# Altium schematic sheet MCISO-S03-V00-CAN_MAIN.SchDoc
size A3; SheetNumber: 6; SheetTotal: 8
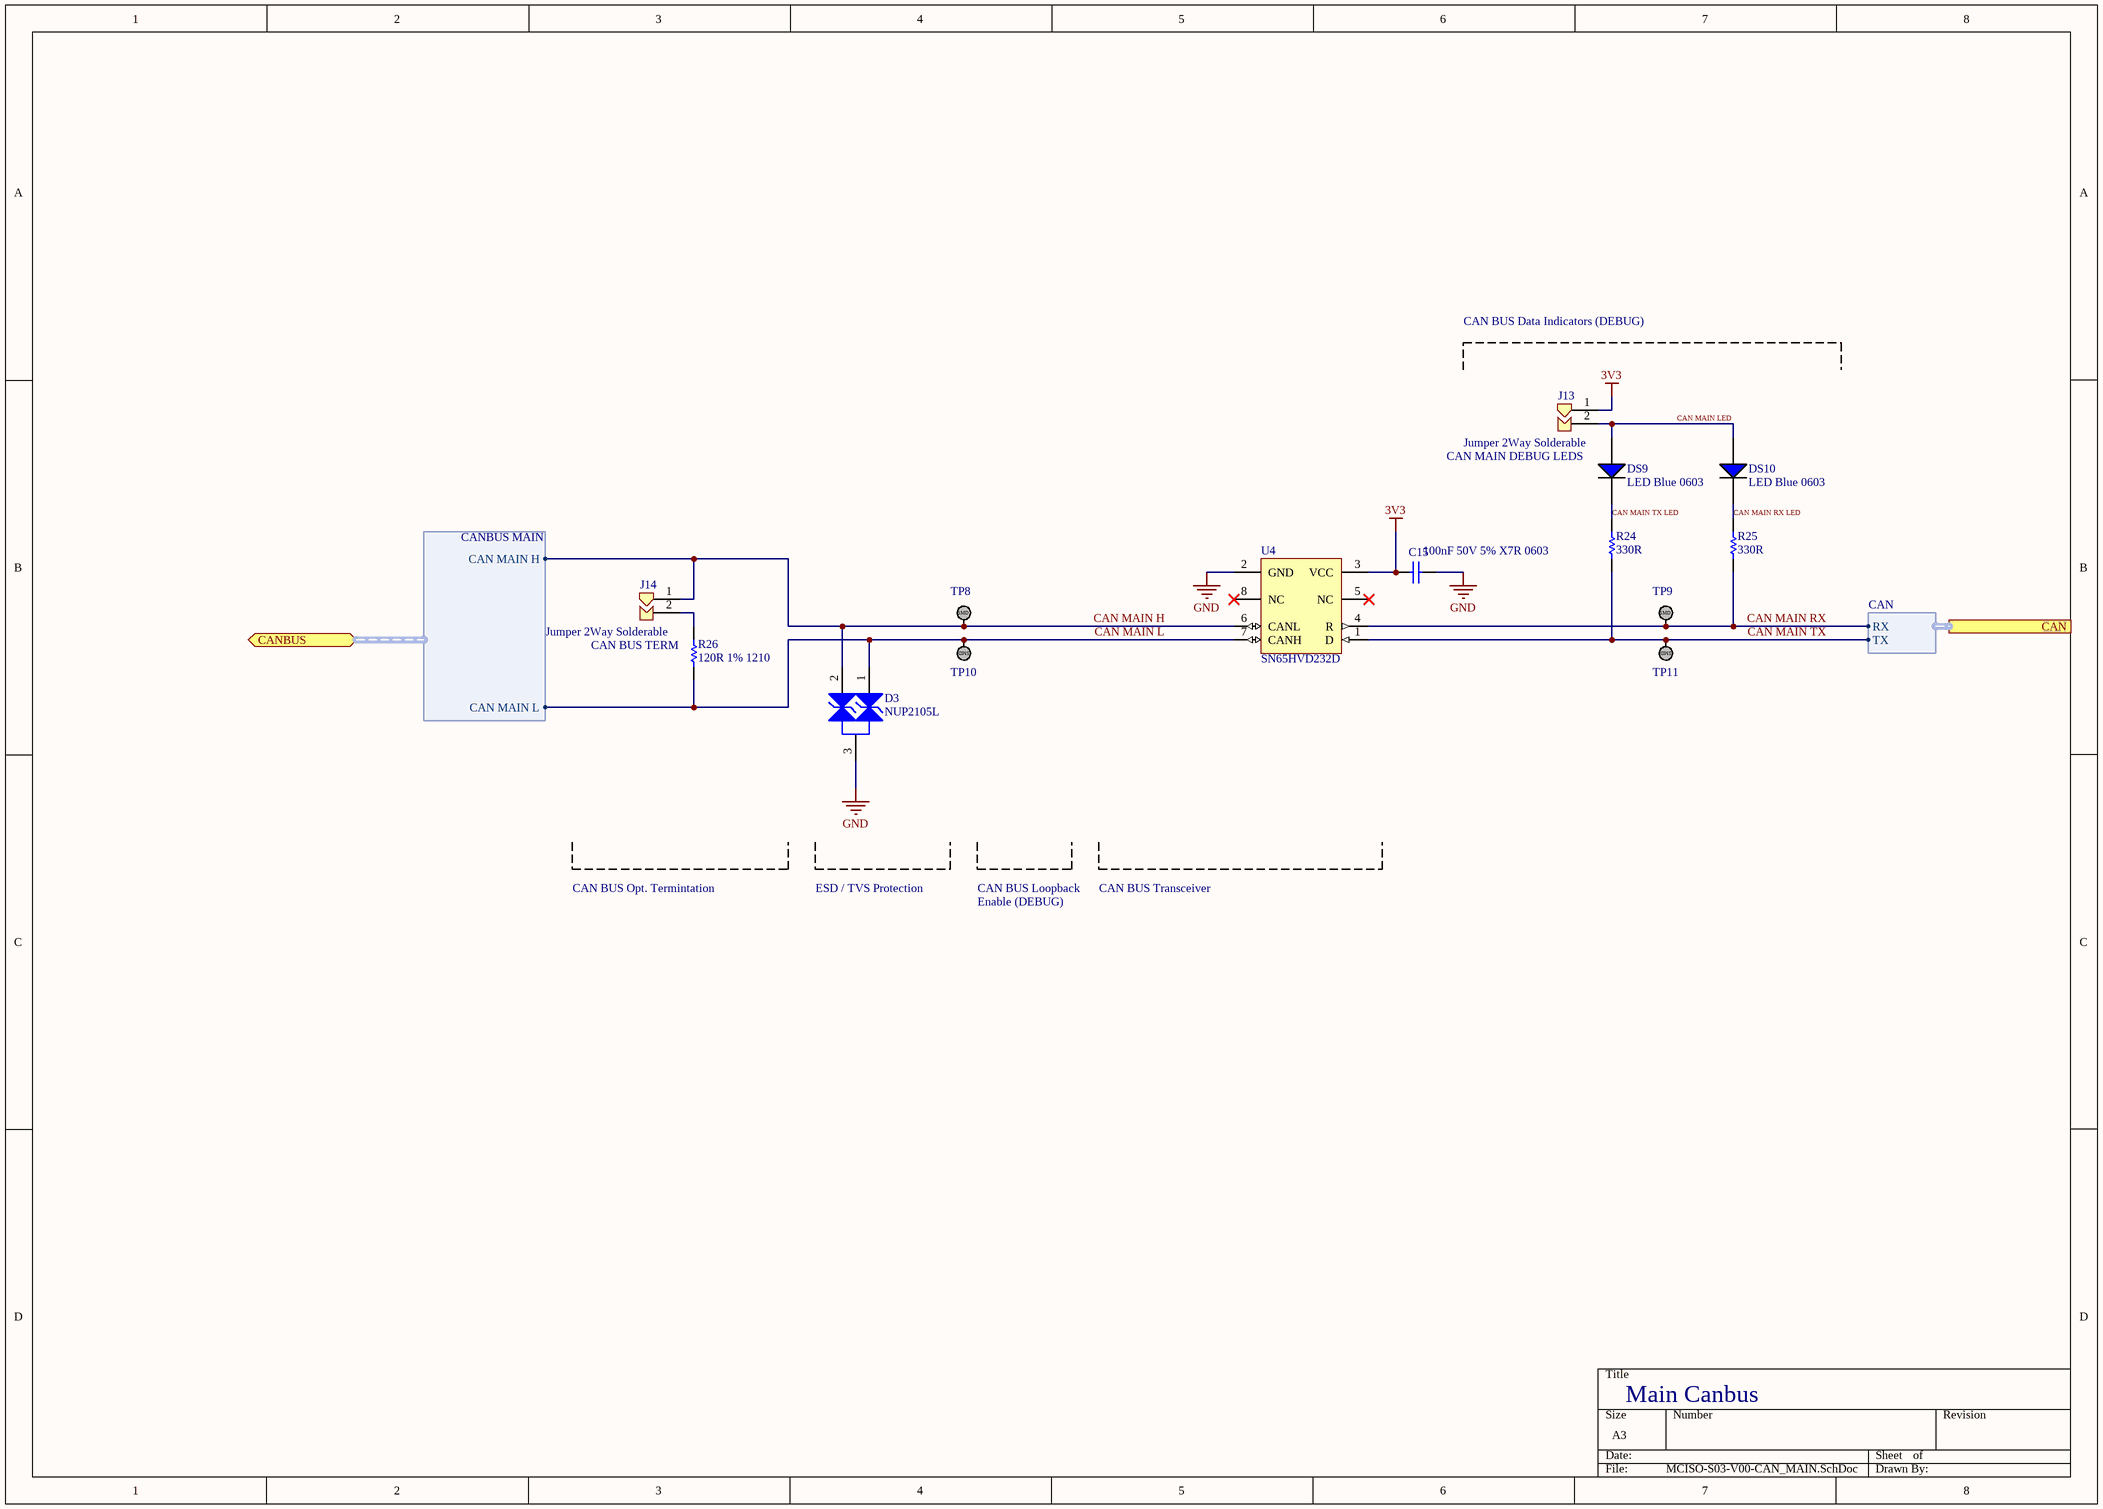
[diagram p0: MCISO-S03-V00-CAN_MAIN.SchDoc]

## Parts
C15  100nF 50V 5% X7R 0603  [Cap_Ceramic_0603]
D3  NUP2105L  [NUP2105L]
DS9  LED Blue 0603  [LED BLUE 0603]
DS10  LED Blue 0603  [LED BLUE 0603]
J13  Jumper 2Way Solderable  [Jumper_2Way_Solderable]
J14  Jumper 2Way Solderable  [Jumper_2Way_Solderable]
R24  330R  [Res_ThinFilm_0603]
R25  330R  [Res_ThinFilm_0603]
R26  120R 1% 1210  [Res_ThinFilm_1210]
TP8  TestPoint_SMD  [TestPointSMD]  (value not drawn)
TP9  TestPoint_SMD  [TestPointSMD]  (value not drawn)
TP10  TestPoint_SMD  [TestPointSMD]  (value not drawn)
TP11  TestPoint_SMD  [TestPointSMD]  (value not drawn)
U4  SN65HVD232D  [D0008A_L]

## Ports
CAN (harness CAN), CANBUS (bidir, harness CANBUS MAIN)

## Harnesses
CANBUS MAIN: CAN MAIN H, CAN MAIN L
CAN: TX, RX

## Nets
3V3: C15.1 J13.1 U4.3(VCC)
GND: C15.2 D3.3 U4.2(GND)
CAN MAIN H: D3.2 J14.1 TP8.1 U4.6(CANL) ; port CANBUS.CAN MAIN H
CAN MAIN L: D3.1 R26.1 TP10.1 U4.7(CANH) ; port CANBUS.CAN MAIN L
CAN MAIN LED: DS9.1(A) DS10.1(A) J13.2
CAN MAIN RX: R25.1 TP9.1 U4.4(R) ; port CAN.RX
CAN MAIN RX LED: DS10.2(C) R25.2
CAN MAIN TX: R24.1 TP11.1 U4.1(D) ; port CAN.TX
CAN MAIN TX LED: DS9.2(C) R24.2
NetJ14_2: J14.2 R26.2

Not connected (* = marked no-connect by the designer): U4 5(NC)* 8(NC)*

## Notes on the sheet
- CAN BUS Data Indicators (DEBUG)
- CAN MAIN DEBUG LEDS
- (near R26) CAN BUS TERM
- CAN BUS Opt. Termintation
- ESD / TVS Protection
- CAN BUS Loopback
- Enable (DEBUG)
- CAN BUS Transceiver
- Main Canbus
- (in symbol TestPoint_SMD) SMD

## Library data of the parts
C15 = 100nF 50V 5% X7R 0603: Capacitor, Ceramic, SMD, 100nF, 50V, 5%, X7R, 0603
J13 J14 = Jumper 2Way Side Solderable
R24 R25 = 330R 5% 0603: Resistor, SMD, 330R, 0.1W, 5%, 0603
R26 = 120R 1% 1210: Resistor, SMD, 120R, 0.25W, 1%, 1210
U4 = CMP-0315-00073-2: 3.3 V CAN Transceiver, 17 mA, -40 to 85 degC, 8-pin SOIC (D), Green (RoHS & no Sb/Br); Manufacturer: Texas Instruments; Supply Voltage(s)(V): 3.3; Transient Pulse Protection(V): -25 to 25; ICC(Max)(mA): 17; Drivers Per Package: 1; Rating: Catalog; Code_JEDEC: MS-012AA; Mounting Technology: Surface Mount; PackageDescription: 8-Pin Plastic Small Outline Integrated Circuit, 4.9 x 3.9 mm, Pitch 1.27 mm Pitch; SubFamily: CAN; PackageVersion: revM, Jun-2011; Isolated: No; DatasheetVersion: SLOS346K; PackageReference: D0008A; Receivers Per Package: 1; Footprint: SN65HVD232; ComponentLink1Description: Datasheet; PartNumber: SN65HVD232D; Eco-Plan: Green (RoHS & no Sb/Br); ComponentLink1URL: http://www.ti.com/general/docs/lit/getliterature.tsp?genericPartNumber=SN65HVD232&fileType=pdf
D3 = NUP2105L: ComponentLink1Description: Datasheet; ComponentLink1URL: https://www.onsemi.cn/PowerSolutions/document/NUP2105L-D.PDF; Parameter 1: *; ComponentLink2Description: LCSC; ComponentLink2URL: https://lcsc.com/product-detail/TVS_ON-Semiconductor-NUP2105LT1G_C14486.html; ComponentLink3Description: Digikey; ComponentLink3URL: https://www.digikey.com.au/product-detail/en/on-semiconductor/SZNUP2105LT1G/SZNUP2105LT1GOSCT-ND/3487669